# Altium schematic sheet Filtre Passe-Bas.SchDoc
size A4; SheetNumber: 2; SheetTotal: 2
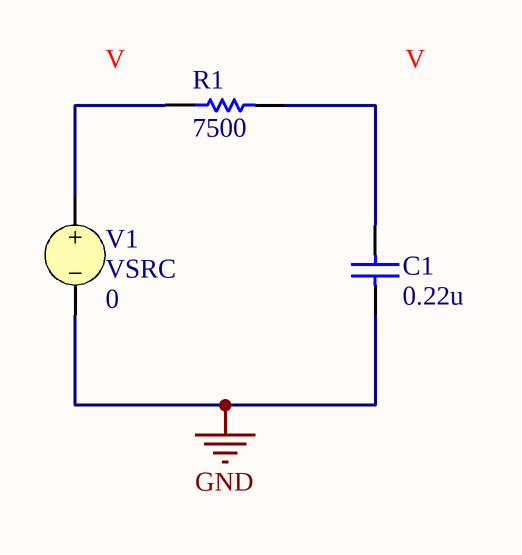
[diagram p0: Filtre Passe-Bas.SchDoc]

## Parts
C1  value 0.22u  (hidden comment: Capacitor)
R1  value 7500  (hidden comment: Resistor)
V1  VSRC  DC Magnitude: 0

## Nets
GND: C1.1 V1.2
NetC1_2: C1.2 R1.2
NetR1_1: R1.1 V1.1

## Library data of the parts
C1 = Capacitor: SimulationGenericComponent: True
R1 = Resistor: TC1: 0; SimulationGenericComponent: True; TC2: 0
V1 = VSRC: Voltage Source; Note: PCB Footprint - Not required; Amplitude: 3; Frequency: 10k; Published: 30-July-2020; LatestRevisionDate: 30-July-2020; LatestRevisionNote: Re-released for DXP Platform.; PackageReference: Not Applicable; Publisher: Altium Limited; AC Magnitude: 0; AC Phase: 0; Offset: 0; Delay: 0; Damping Factor: 0; Phase: 0